# Altium schematic sheet 2_power.SchDoc
size A4; SheetNumber: 3; SheetTotal: 13
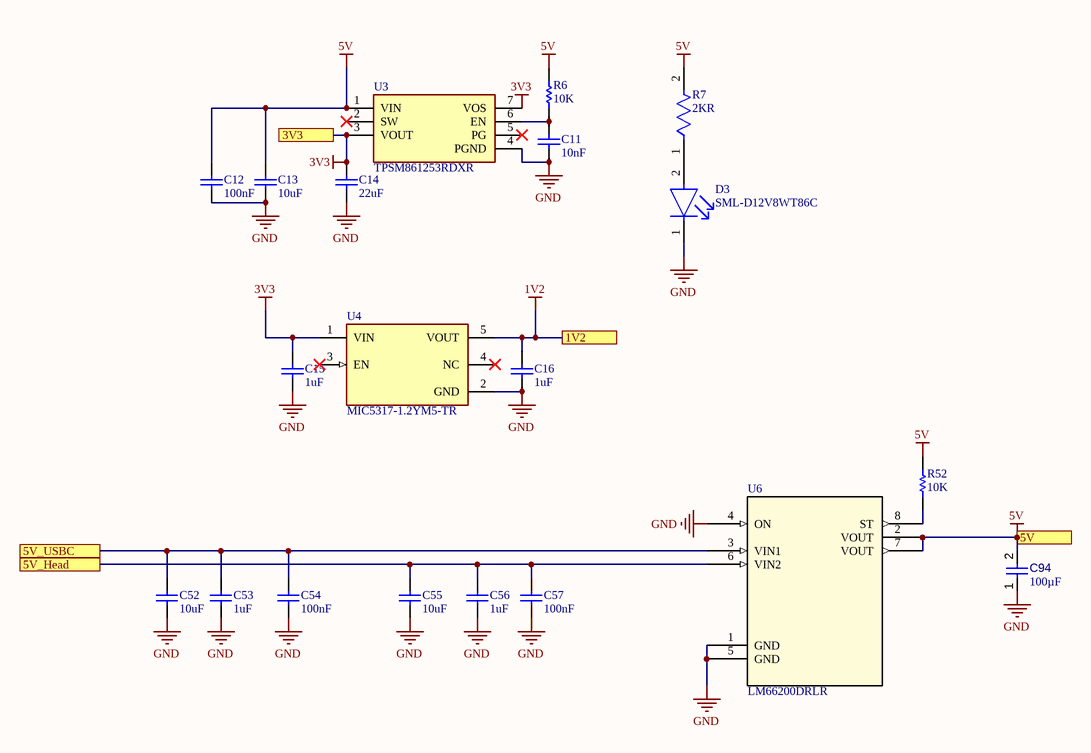
[diagram p0: 2_power.SchDoc]

## Parts
C11  10nF  [CAPC1608X90X35ML15T15]
C12  100nF  [CAPC1608X90X35ML15T15]
C13  10uF  [CAPC1608X90X35ML15T15]
C14  22uF  [CAPC1608X90X35ML15T15]
C15  1uF  [CAPC1608X90X35LL15T15]
C16  1uF  [CAPC1608X90X35LL15T15]
C52  10uF  [CAPC1608X90X35ML15T15]
C53  1uF  [CAPC1608X90X35LL15T15]
C54  100nF  [CAPC1608X90X35ML15T15]
C55  10uF  [CAPC1608X90X35ML15T15]
C56  1uF  [CAPC1608X90X35LL15T15]
C57  100nF  [CAPC1608X90X35ML15T15]
C94  value 100µF  [CAPC0805(2012)145_L]  (hidden comment: Capacitor 100µF +/-20% 6.3V 0805)
D3  SML-D12V8WT86C  [FP-SML-D12-MFG]
R6  10K  [RESC1609X55X30NL10T20]
R7  2KR  [FP-CPF0603-MFG]
R52  10K  [RESC1609X55X30NL10T20]
U3  TPSM861253RDXR  [QFN-7_L4.0-W3.3_TPSM863257RDXR]
U4  MIC5317-1.2YM5-TR  [FP-SOT23-5LD-PL-1-MFG]
U6  LM66200DRLR  [SOT-5X3_DRL_TEX]

## Ports
1V2, 3V3, 5V, 5V_Head, 5V_USBC

## Nets
1V2: C16.2 U4.5(VOUT) ; port 1V2
3V3: C14.2 C15.2 U3.3(VOUT) U3.7(VOS) U4.1(VIN) ; port 3V3
5V: C12.2 C13.2 C94.2 R6.2 R7.2 R52.2 U3.1(VIN) U6.2(VOUT) U6.7(VOUT) ; port 5V
GND: C11.1 C12.1 C13.1 C14.1 C15.1 C16.1 C52.1 C53.1 C54.1 C55.1 C56.1 C57.1 C94.1 D3.1(C) U3.4(PGND) U4.2(GND) U6.1(GND) U6.4(ON) U6.5(GND)
5V_Head: C55.2 C56.2 C57.2 U6.6(VIN2) ; port 5V_Head
5V_USBC: C52.2 C53.2 C54.2 U6.3(VIN1) ; port 5V_USBC
NetC11_2: C11.2 R6.1 U3.6(EN)
NetD3_2: D3.2(A) R7.1
NetR52_1: R52.1 U6.8(ST)

Not connected (* = marked no-connect by the designer): U3 2(SW)* 5(PG)*; U4 3(EN)* 4(NC)*

## Notes on the sheet
- Date:
- A4
- Project:
- Time:
- Sheet
- of
- Revision:
- File:
- Drawn By:

## Library data of the parts
C11-C14 C52 C54 C55 C57 = CMP-2006-04205-1: Manufacturer: AVX Interconnect / Elco; Part Number: 06034D226MAT2A
C15 C16 C53 C56 = CMP-2006-02241-1: Part Number: C0603C105K9PACTU; Manufacturer: Kemet
C94 = CMP-001-00054-4: Chip Capacitor, 100µF +/-20%, 6.3V, 0805, Thickness 1.45 mm; Tolerance: 10%; Min Operating Temperature: -55°C; Max Operating Temperature: 85°C; Pins: 2; Mounting Technology: SMT; Case/Package: 0805; Voltage Rating: 6.3V
D3 = CMP-08952-000027-1: LED RED 1608 SMD; Forward Voltage: 2.2V; Luminous Intensity: 40mcd; Lens Size: 0.8mm; Lens Style: Flat; Lens Color: White; Test Current: 20mA; Dominant Wavelength: 630nm; Height: 0.65mm; Length: 1.6mm; Case Code (Metric): 1608; Color: Red; Mount: Surface Mount; Width: 0.8mm; Case Code (Imperial): 0603; Case/Package: 0603; Packaging: Tape and Reel
R6 R52 = CMP-2000-03692-1: Manufacturer: Vishay Dale; Part Number: TNPW060310K0BEEN
R7 = CMP-03211-009149-1: RES SMD 2.0KΩ 1% 1/16W 0603; Manufacturer: TE Connectivity; Manufacturer Part Number: CPF0603F2K0C1; Power Rating: 0.063W; Temperature Coefficient: 50ppm/°C; Voltage Rating: 50V; Temperature Range High: +155°C; Category: Res; Octopart: https://octopart.com/cpf0603f2k0c1-te+connectivity-7514873; ComponentLink2URL: https://www.te.com/commerce/DocumentDelivery/DDEController?Action=showdoc&DocId=Data+Sheet%7F1773200%7FM%7Fpdf%7FEnglish%7FENG_DS_1773200_M.pdf%7F3-1676481-2; Device Class L3: Chip SMD Resistors; Temperature Range Low: -55°C; Automotive: No; Lead Free: Yes; Device Class L2: Resistors; Device Class L1: Passive Components; Resistance: 2.0KΩ; octopart_url: https://octopart.com/cpf0603f2k0c1-te+connectivity-7514873; packaging: 1k Reel; Composition: Thin Film; ComponentLink2Description: Datasheet; Temperature: -55°C to +155°C; Package: CPF0603; RoHS: TRUE; Ipc Land Pattern Name: RESC15580X45; Tolerance: 1%; Value: 2.0KΩ; Height: 0.55mm; Series: CPF
U3 = TPSM861253RDXR: Function:Step-down type Number of Outputs:1 Voltage - Supply:3V~17V Voltage - Supply:3V~17V Conversion Efficiency:- Conversion Efficiency:- Output Voltage:3.3V Output Voltage:3.3V Output Voltage Accuracy:±1% Output Voltage Accuracy:±1% Output Current(Max); Manufacturer: TI(德州仪器); Number of Outputs: 1; Voltage - Supply: 3V~17V; Output Voltage: 3.3V; Output Voltage Accuracy: ±1%; Output Current(Max): 1A; Quiescent Supply Current: 370uA; Ripple Noise: 20mVp-p; Switching Frequency: 1.4MHz; LCSC Part Name: 3V至17V输入、1A同步降压模块; Supplier Part: C31183817; Manufacturer Part: TPSM861253RDXR; Supplier Footprint: QFN-FCMOD-7(3.3x4); JLCPCB Part Class: Extended Part; Datasheet: https://www.ti.com.cn/cn/lit/ds/symlink/tpsm861252.pdf?ts=1729502160167&ref_url=https%253A%252F%252Fwww.ti.com.cn%252Fsitesearch%252Fzh-cn%252Fdocs%252Funiversalsearch.tsp%253FlangPref%253Dzh-CN%2526nr%253D9%2526searchTerm%253DTPSM861252RDXR; Supplier: LCSC; Function: Step-down type; Operating Temperature Range: -40℃~+125℃; Length: 4mm; Width: 3.3mm; Height: 2mm; Features: Overvoltage protection；Over-temperature protection；Over Current Protection；Under Voltage Protection；Automatic fault recovery
U4 = CMP-00252-66802792-1: MIC5317-1.8YM5-TR LDO Regulator Pos 1.8V 0.15A 5-Pin SOT-23 T/R; Number of Outputs: 1; Dropout Voltage: 155mV; Power Supply Rejection Ratio (PSRR): 70dB; Max Input Voltage: 6V; Min Input Voltage: 2.5V; Output Current: 150mA; Min Current Limit: 200mA; Schedule B: 8542390000, 8542390000; Min Operating Temperature: -40°C; Lifecycle Status: Production; NexarPartId: 66802792; Mount: Surface Mount; Output Voltage: 1.8V; Number of Regulators: 1; RoHS: Compliant; Case/Package: SOT-23-5; Max Operating Temperature: 125°C
U6 = CMP-005-000000-1: 1.6-V to 5.5-V, 40-mâ„; Manufacturer_Name: Texas Instruments; Manufacturer_Part_Number: LM66200DRLR; Pin Count: 8; Source: LM66200DRLR.SchLib; Type: Type; Component Type: Standard; Design Item ID: LM66200DRLR; Copyright: Copyright (C) 2025 Ultra Librarian. All rights reserved.; RefDes: RefDes